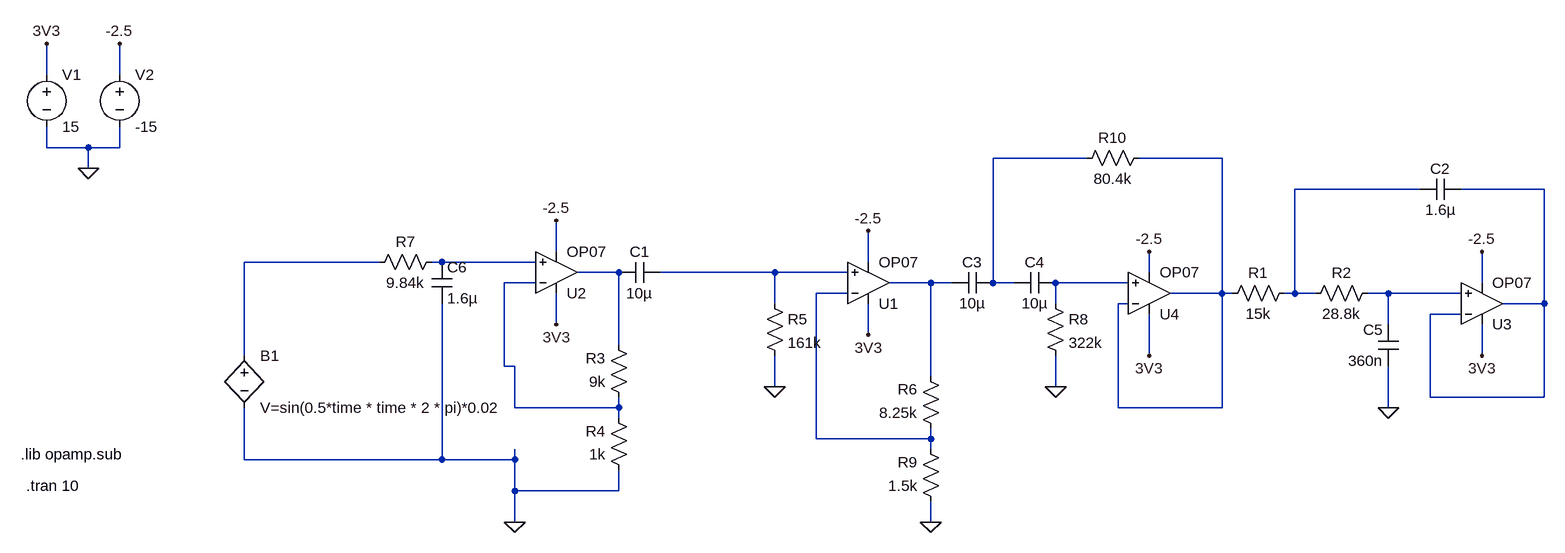
[diagram p0: schematic analog_filter_wizard.asc]
analog_filter_wizard.asc, the LTspice schematic file:
Version 4
SHEET 1 2420 680
WIRE -464 -144 -464 -192
WIRE -352 -144 -352 -192
WIRE -464 -32 -464 -64
WIRE -400 -32 -464 -32
WIRE -352 -32 -352 -64
WIRE -352 -32 -400 -32
WIRE 1136 -16 992 -16
WIRE 1344 -16 1216 -16
WIRE -400 0 -400 -32
WIRE 1648 32 1456 32
WIRE 1840 32 1712 32
WIRE 320 128 320 80
WIRE 48 144 -160 144
WIRE 144 144 128 144
WIRE 288 144 144 144
WIRE 800 144 800 96
WIRE 416 160 352 160
WIRE 656 160 480 160
WIRE 768 160 656 160
WIRE 1232 160 1232 128
WIRE 288 176 240 176
WIRE 896 176 832 176
WIRE 928 176 896 176
WIRE 992 176 992 -16
WIRE 1024 176 992 176
WIRE 1200 176 1088 176
WIRE 1744 176 1744 128
WIRE 768 192 720 192
WIRE 1344 192 1344 -16
WIRE 1344 192 1264 192
WIRE 1360 192 1344 192
WIRE 1456 192 1456 32
WIRE 1456 192 1440 192
WIRE 1488 192 1456 192
WIRE 1600 192 1568 192
WIRE 1712 192 1600 192
WIRE 656 208 656 160
WIRE 1088 208 1088 176
WIRE 1200 208 1184 208
WIRE 1840 208 1840 32
WIRE 1840 208 1776 208
WIRE 1712 224 1664 224
WIRE 320 240 320 192
WIRE 1600 240 1600 192
WIRE 800 256 800 208
WIRE 416 272 416 160
WIRE -160 288 -160 144
WIRE 1232 288 1232 224
WIRE 1744 288 1744 240
WIRE 240 304 240 176
WIRE 256 304 240 304
WIRE 896 320 896 176
WIRE 656 336 656 288
WIRE 1088 336 1088 288
WIRE 1664 352 1664 224
WIRE 1840 352 1840 208
WIRE 1840 352 1664 352
WIRE 256 368 256 304
WIRE 416 368 416 352
WIRE 416 368 256 368
WIRE 1184 368 1184 208
WIRE 1344 368 1344 192
WIRE 1344 368 1184 368
WIRE 1600 368 1600 304
WIRE 416 384 416 368
WIRE 720 416 720 192
WIRE 896 416 896 400
WIRE 896 416 720 416
WIRE 896 432 896 416
WIRE -160 448 -160 368
WIRE 144 448 144 208
WIRE 144 448 -160 448
WIRE 256 448 256 432
WIRE 256 448 144 448
WIRE 256 496 256 448
WIRE 416 496 416 464
WIRE 416 496 256 496
WIRE 256 544 256 496
WIRE 896 544 896 512
FLAG -400 0 0
FLAG -464 -192 3V3
FLAG -352 -192 -2.5
FLAG 320 240 3V3
FLAG 320 80 -2.5
FLAG 256 544 0
FLAG 656 336 0
FLAG 800 256 3V3
FLAG 800 96 -2.5
FLAG 1600 368 0
FLAG 1744 288 3V3
FLAG 1744 128 -2.5
FLAG 1088 336 0
FLAG 1232 128 -2.5
FLAG 1232 288 3V3
FLAG 896 544 0
SYMBOL res 432 368 R180
WINDOW 0 36 76 Left 2
WINDOW 3 36 40 Left 2
SYMATTR InstName R3
SYMATTR Value 9k
SYMBOL res 432 480 R180
WINDOW 0 36 76 Left 2
WINDOW 3 36 40 Left 2
SYMATTR InstName R4
SYMATTR Value 1k
SYMBOL OpAmps\\OP07 320 224 M180
SYMATTR InstName U2
SYMBOL voltage -464 -160 R0
WINDOW 123 0 0 Left 0
WINDOW 39 0 0 Left 0
SYMATTR InstName V1
SYMATTR Value 15
SYMBOL voltage -352 -160 R0
WINDOW 123 0 0 Left 0
WINDOW 39 0 0 Left 0
SYMATTR InstName V2
SYMATTR Value -15
SYMBOL OpAmps\\OP07 800 240 M180
SYMATTR InstName U1
SYMBOL OpAmps\\OP07 1744 272 M180
SYMATTR InstName U3
SYMBOL res 144 128 R90
WINDOW 0 0 56 VBottom 2
WINDOW 3 32 56 VTop 2
SYMATTR InstName R7
SYMATTR Value 9.84k
SYMBOL cap 128 144 R0
SYMATTR InstName C6
SYMATTR Value 1.6µ
SYMATTR SpiceLine V=6.3 Irms=595m Rser=0.192493 Lser=0
SYMBOL res 1072 192 R0
SYMATTR InstName R8
SYMATTR Value 322k
SYMBOL OpAmps\\OP07 1232 256 M180
SYMATTR InstName U4
SYMBOL bv -160 272 R0
SYMATTR InstName B1
SYMATTR Value V=sin(0.5*time * time * 2 * pi)*0.02
SYMBOL cap 480 144 R90
WINDOW 0 0 32 VBottom 2
WINDOW 3 32 32 VTop 2
SYMATTR InstName C1
SYMATTR Value 10µ
SYMBOL res 640 192 R0
SYMATTR InstName R5
SYMATTR Value 161k
SYMBOL res 912 416 R180
WINDOW 0 36 76 Left 2
WINDOW 3 36 40 Left 2
SYMATTR InstName R6
SYMATTR Value 8.25k
SYMBOL res 912 528 R180
WINDOW 0 36 76 Left 2
WINDOW 3 36 40 Left 2
SYMATTR InstName R9
SYMATTR Value 1.5k
SYMBOL cap 992 160 R90
WINDOW 0 0 32 VBottom 2
WINDOW 3 32 32 VTop 2
SYMATTR InstName C3
SYMATTR Value 10µ
SYMBOL cap 1088 160 R90
WINDOW 0 0 32 VBottom 2
WINDOW 3 32 32 VTop 2
SYMATTR InstName C4
SYMATTR Value 10µ
SYMBOL res 1232 -32 R90
WINDOW 0 0 56 VBottom 2
WINDOW 3 32 56 VTop 2
SYMATTR InstName R10
SYMATTR Value 80.4k
SYMBOL res 1456 176 R90
WINDOW 0 0 56 VBottom 2
WINDOW 3 32 56 VTop 2
SYMATTR InstName R1
SYMATTR Value 15k
SYMBOL res 1584 176 R90
WINDOW 0 0 56 VBottom 2
WINDOW 3 32 56 VTop 2
SYMATTR InstName R2
SYMATTR Value 28.8k
SYMBOL cap 1712 16 R90
WINDOW 0 0 32 VBottom 2
WINDOW 3 32 32 VTop 2
SYMATTR InstName C2
SYMATTR Value 1.6µ
SYMBOL cap 1616 304 R180
WINDOW 0 24 56 Left 2
WINDOW 3 24 8 Left 2
SYMATTR InstName C5
SYMATTR Value 360n
TEXT -496 488 Left 2 !.tran 10
TEXT -504 440 Left 2 !.lib opamp.sub

The netlist it stands for:
* analog_filter_wizard.asc
R3 N009 N007 9k
R4 0 N009 1k
XU2 N006 N009 3V3 -2.5 N007 LT1001  ; OP07, pins In+ In- V+ V- OUT
V1 3V3 0 15
V2 -2.5 0 -15
XU1 N008 N012 3V3 -2.5 N010 LT1001  ; OP07, pins In+ In- V+ V- OUT
XU3 N013 N004 3V3 -2.5 N004 LT1001  ; OP07, pins In+ In- V+ V- OUT
R7 N006 N005 9.84k
C6 N006 0 1.6µ V=6.3 Irms=595m Rser=0.192493 Lser=0
R8 N011 0 322k
XU4 N011 N002 3V3 -2.5 N002 LT1001  ; OP07, pins In+ In- V+ V- OUT
B1 N005 0 V=sin(0.5*time * time * 2 * pi)*0.02
C1 N008 N007 10µ
R5 N008 0 161k
R6 N012 N010 8.25k
R9 0 N012 1.5k
C3 N001 N010 10µ
C4 N011 N001 10µ
R10 N002 N001 80.4k
R1 N003 N002 15k
R2 N013 N003 28.8k
C2 N004 N003 1.6µ
C5 0 N013 360n
.tran 10
.lib opamp.sub
.lib LTC.lib
.backanno
.end